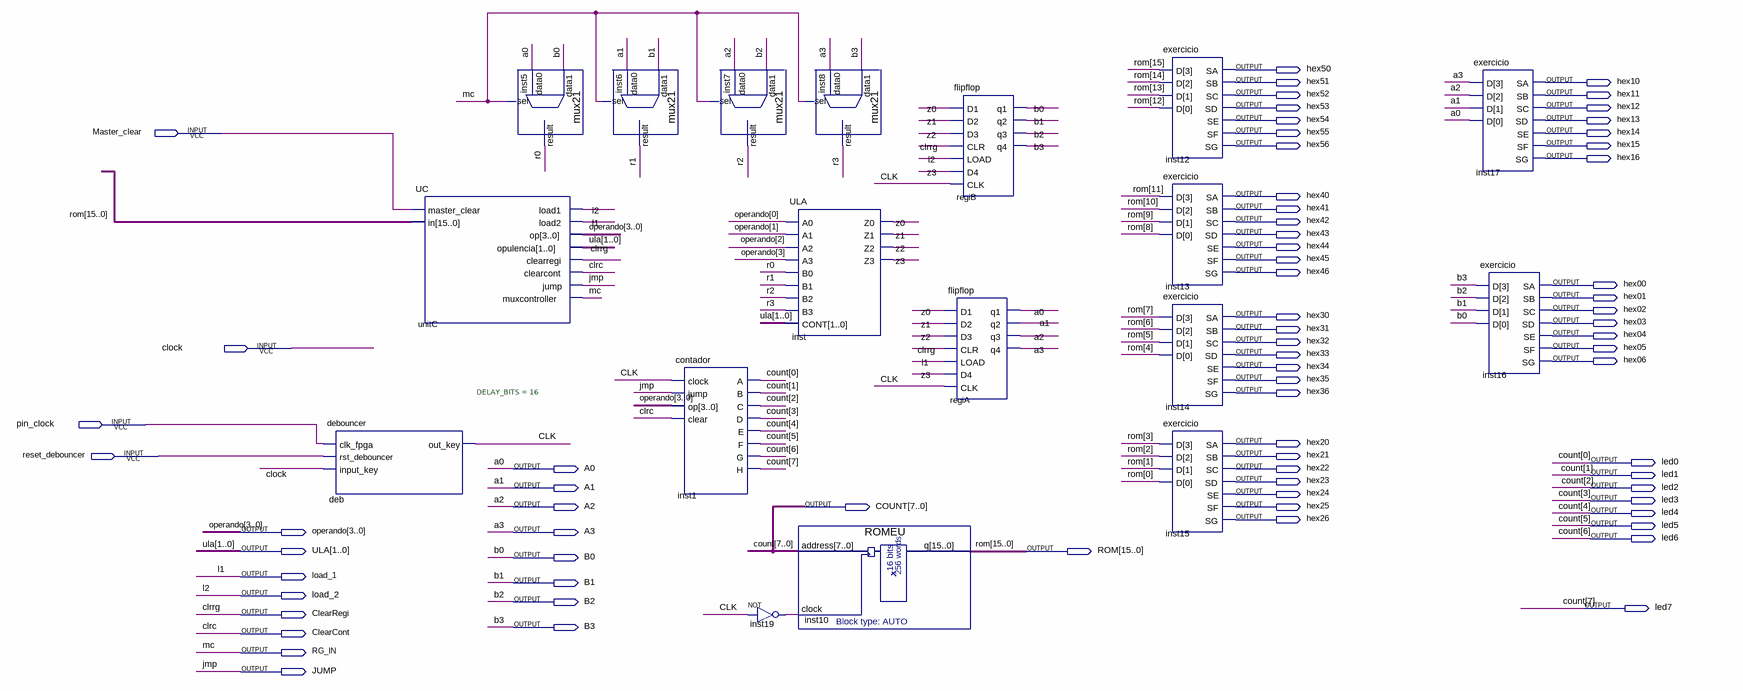
[diagram p0: schematic sheet]
// Quartus schematic cpu.bdf as structural Verilog: 18 symbols, 72 pins
module cpu (
  input  Master_clear,
  input  clock,
  input  pin_clock,
  input  reset_debouncer,
  output hex50,
  output hex51,
  output hex10,
  output hex52,
  output hex11,
  output hex53,
  output hex12,
  output hex54,
  output hex13,
  output hex55,
  output hex14,
  output hex56,
  output hex15,
  output hex16,
  output hex40,
  output hex41,
  output hex42,
  output hex43,
  output hex44,
  output hex45,
  output hex46,
  output hex00,
  output hex01,
  output hex02,
  output hex30,
  output hex03,
  output hex31,
  output hex04,
  output hex32,
  output hex05,
  output hex33,
  output hex06,
  output hex34,
  output hex35,
  output hex36,
  output hex20,
  output hex21,
  output led0,
  output A0,
  output hex22,
  output led1,
  output hex23,
  output A1,
  output led2,
  output hex24,
  output led3,
  output A2,
  output [7:0] COUNT,
  output hex25,
  output led4,
  output hex26,
  output led5,
  output [3:0] operando,
  output A3,
  output led6,
  output [1:0] ULA,
  output [15:0] ROM,
  output B0,
  output load_1,
  output B1,
  output load_2,
  output B2,
  output led7,
  output ClearRegi,
  output B3,
  output ClearCont,
  output RG_IN,
  output JUMP
);

  wire CLK, inst19_out, r0, r1, r2, r3, z0, z1, z2, z3;

  debouncer #(.DELAY_BITS(16)) deb (
    .clk_fpga(pin_clock), .rst_debouncer(reset_debouncer), .input_key(clock), .out_key(CLK));
  UC unitC (
    .master_clear(Master_clear), .in(ROM), .load1(load_2), .load2(load_1), .op(operando), .opulencia(ULA),
    .clearregi(ClearRegi), .clearcont(ClearCont), .jump(JUMP), .muxcontroller(RG_IN));
  mux21 inst5 (.data1(B0), .data0(A0), .sel(RG_IN), .result(r0));
  mux21 inst6 (.data1(B1), .data0(A1), .sel(RG_IN), .result(r1));
  mux21 inst7 (.data1(B2), .data0(A2), .sel(RG_IN), .result(r2));
  contador inst1 (
    .clock(CLK), .jump(JUMP), .op(operando), .clear(ClearCont), .A(COUNT[0]), .H(COUNT[7]), .B(COUNT[1]),
    .C(COUNT[2]), .D(COUNT[3]), .E(COUNT[4]), .F(COUNT[5]), .G(COUNT[6]));
  not inst19 (inst19_out, CLK);
  mux21 inst8 (.data1(B3), .data0(A3), .sel(RG_IN), .result(r3));
  ULA inst (
    .A0(operando[0]), .A1(operando[1]), .A2(operando[2]), .A3(operando[3]), .B0(r0), .B1(r1), .B2(r2),
    .B3(r3), .CONT(ULA), .Z0(z0), .Z1(z1), .Z2(z2), .Z3(z3));
  ROMEU inst10 (.address(COUNT), .clock(inst19_out), .q(ROM));
  flipflop regiB (
    .D1(z0), .D2(z1), .D3(z2), .CLR(ClearRegi), .LOAD(load_2), .D4(z3), .CLK(CLK), .q1(B0), .q2(B1), .q3(B2),
    .q4(B3));
  flipflop regiA (
    .D1(z0), .D2(z1), .D3(z2), .CLR(ClearRegi), .LOAD(load_1), .D4(z3), .CLK(CLK), .q1(A0), .q2(A1), .q3(A2),
    .q4(A3));
  exercicio inst12 (.D(ROM[15:12]), .SA(hex50), .SB(hex51), .SC(hex52), .SD(hex53), .SE(hex54), .SF(hex55), .SG(hex56));
  exercicio inst13 (.D(ROM[11:8]), .SA(hex40), .SB(hex41), .SC(hex42), .SD(hex43), .SE(hex44), .SF(hex45), .SG(hex46));
  exercicio inst14 (.D(ROM[7:4]), .SA(hex30), .SB(hex31), .SC(hex32), .SD(hex33), .SE(hex34), .SF(hex35), .SG(hex36));
  exercicio inst15 (.D(ROM[3:0]), .SA(hex20), .SB(hex21), .SC(hex22), .SD(hex23), .SE(hex24), .SF(hex25), .SG(hex26));
  exercicio inst17 (
    .D({A3, A2, A1, A0}), .SA(hex10), .SB(hex11), .SC(hex12), .SD(hex13), .SE(hex14), .SF(hex15), .SG(hex16));
  exercicio inst16 (
    .D({B3, B2, B1, B0}), .SA(hex00), .SB(hex01), .SC(hex02), .SD(hex03), .SE(hex04), .SF(hex05), .SG(hex06));

  assign led0 = COUNT[0];
  assign led1 = COUNT[1];
  assign led2 = COUNT[2];
  assign led3 = COUNT[3];
  assign led4 = COUNT[4];
  assign led5 = COUNT[5];
  assign led6 = COUNT[6];
  assign led7 = COUNT[7];

  // Other names for the same wires on the sheet: clrc = ClearCont; clrrg = ClearRegi; jmp = JUMP; l1 = load_1;
  //   l2 = load_2; mc = RG_IN
endmodule
